# Altium schematic sheet Sheet1.SchDoc
size A4; SheetNumber: 1; SheetTotal: 3
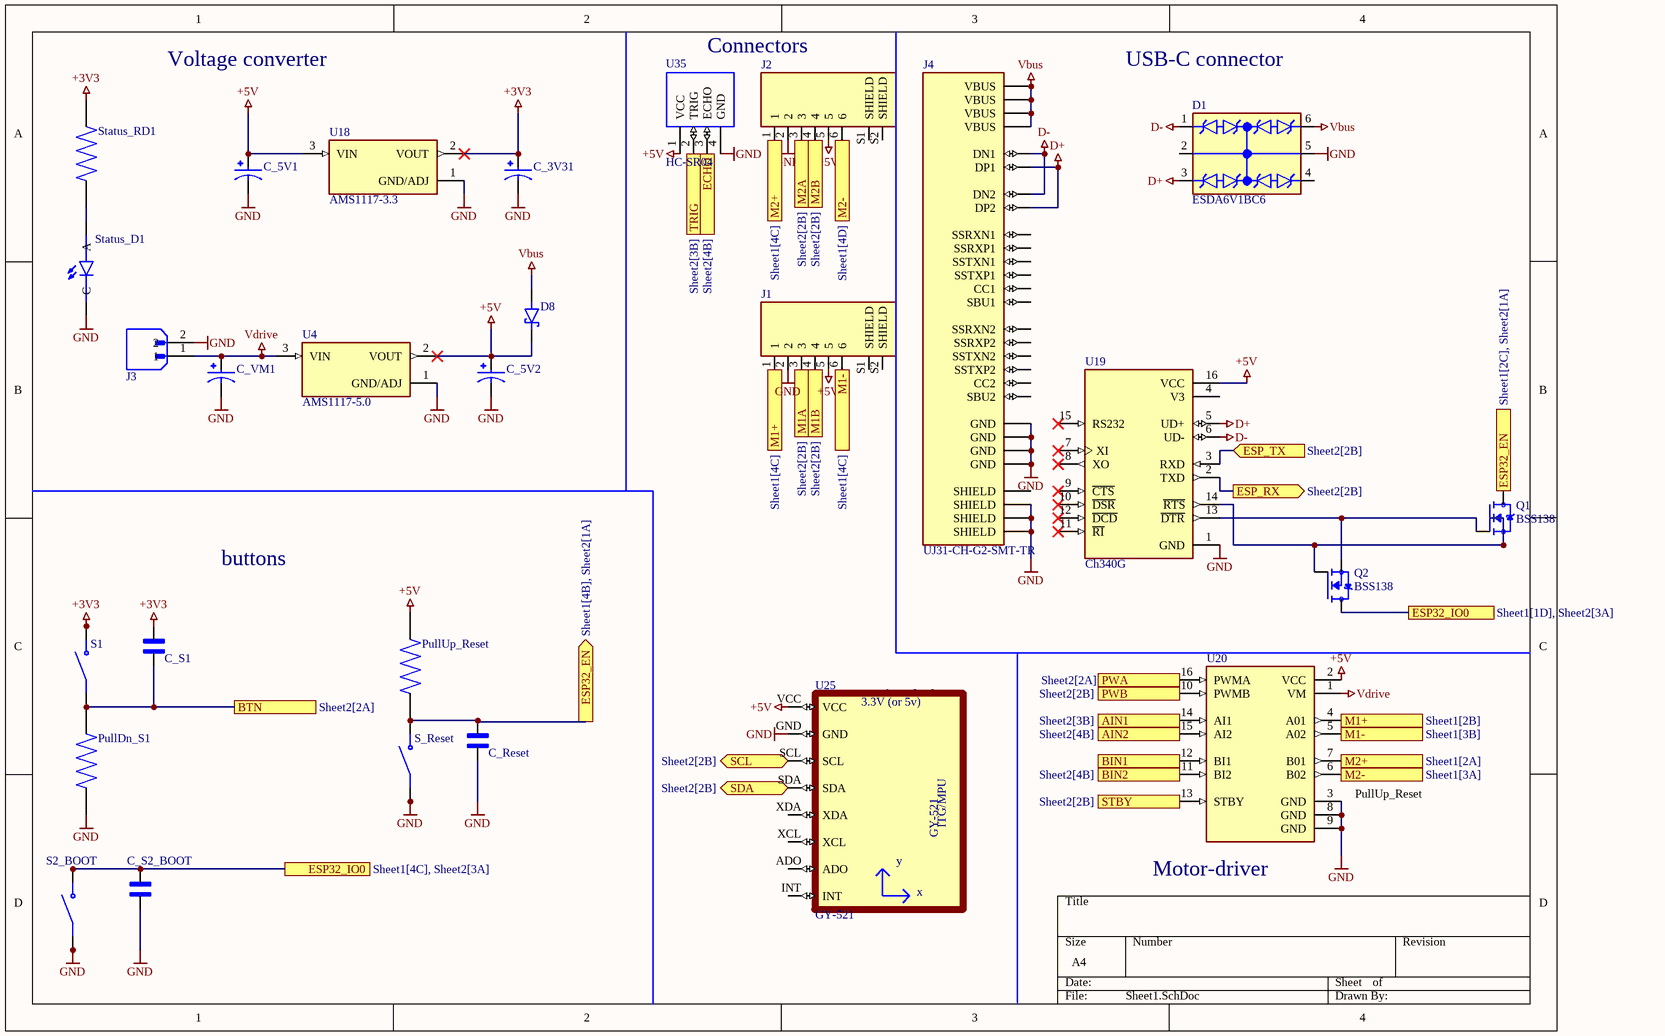
[diagram p0: Sheet1.SchDoc]

## Parts
C_3V31  EEE-HC1H3R3R  [CAP_EEEHC1H3R3R]  (value not drawn)
C_5V1  EEE-HC1H3R3R  [CAP_EEEHC1H3R3R]  (value not drawn)
C_5V2  EEE-HC1H3R3R  [CAP_EEEHC1H3R3R]  (value not drawn)
C_Reset  GRM033R61C224ME14D  [CAPC0603X33N]  (value not drawn)
C_S1  GRM033R61C224ME14D  [CAPC0603X33N]  (value not drawn)
C_S2_BOOT  GRM033R61C224ME14D  [CAPC0603X33N]  (value not drawn)
C_VM1  EEE-HC1H3R3R  [CAP_EEEHC1H3R3R]  (value not drawn)
D1  ESDA6V1BC6  [SOT95P280X145-6N]
D8  1N5819HW-7  [SOD3715X145N]  (value not drawn)
J1  S6B-PH-SM4-TB (LF)(SN)  [JST_S6B-PH-SM4-TB(LF)(SN)]  (value not drawn)
J2  S6B-PH-SM4-TB (LF)(SN)  [JST_S6B-PH-SM4-TB(LF)(SN)]  (value not drawn)
J3  S2B-XH-A-1(LF)(SN)  [JST_S2B-XH-A-1(LF)(SN)]  (value not drawn)
J4  UJ31-CH-G2-SMT-TR  [CUI_UJ31-CH-G2-SMT-TR]
PullDn_S1  CRG0402F4K7  [RESC1005X40N]  (value not drawn)
PullUp_Reset  CRG0402F4K7  [RESC1005X40N]  (value not drawn)
Q1  BSS138  [SOT95P240X111-3N]
Q2  BSS138  [SOT95P240X111-3N]
S1  FSM2JSMLTR  [SW_1571527-2]  (value not drawn)
S2_BOOT  FSM2JSMLTR  [SW_1571527-2]  (value not drawn)
S_Reset  FSM2JSMLTR  [SW_1571527-2]  (value not drawn)
Status_D1  597-5004-407F  [LEDSC160X80X70L45N]  (value not drawn)
Status_RD1  CRG0201F1K4  [RESC0603X26N]  (value not drawn)
U4  AMS1117-5.0  [SOT229P700X180-4N]
U18  AMS1117-3.3  [SOT229P700X180-4N]
U19  Ch340G  [SOIC127P600X180-16N]
U20  ROB-14450  [MODULE_ROB-14450]  (value not drawn)
U25  GY-521  [GY-521]
U35  HC-SR04  [XCVR_HC-SR04]

## Ports
AIN1 (in, see Sheet2[3B]), AIN2 (in, see Sheet2[4B]), BIN1 (in, see Sheet2[3B]), BIN2 (in, see Sheet2[4B]), BTN (see Sheet2[2A]), ECHO (see Sheet2[4B]), ESP32_EN (out, see Sheet1[2C], Sheet2[1A]), ESP32_EN (out, see Sheet1[4B], Sheet2[1A]), ESP32_IO0 (see Sheet1[1D], Sheet2[3A]), ESP32_IO0 (see Sheet1[4C], Sheet2[3A]), ESP_RX (out, see Sheet2[2B]), ESP_TX (in, see Sheet2[2B]), M1+ (out, see Sheet1[2B]), M1+ (out, see Sheet1[4C]), M1- (out, see Sheet1[3B]), M1- (out, see Sheet1[4C]), M1A (see Sheet2[2B]), M1B (see Sheet2[2B]), M2+ (out, see Sheet1[2A]), M2+ (out, see Sheet1[4C]), M2- (out, see Sheet1[3A]), M2- (out, see Sheet1[4D]), M2A (see Sheet2[2B]), M2B (see Sheet2[2B]), PWA (in, see Sheet2[2A]), PWB (in, see Sheet2[2B]), SCL (bidir, see Sheet2[2B]), SDA (bidir, see Sheet2[2B]), STBY (in, see Sheet2[2B]), TRIG (see Sheet2[3B])

## Nets
+3V3: C_3V31.1 C_S1.2 S1.3(NO) S1.4(NO) Status_RD1.1 U18.2(VOUT)
+5V: C_5V1.1 C_5V2.1 D8.C(K) J1.5 J2.5 PullUp_Reset.2 U4.2(VOUT) U18.3(VIN) U19.16(VCC) U20.2(VCC) U25.VCC U35.1(VCC)
D+: D1.3(C2) J4.A6(DP1) J4.B6(DP2) U19.5(UD+)
D-: D1.1(C1) J4.A7(DN1) J4.B7(DN2) U19.6(UD-)
GND: C_3V31.2 C_5V1.2 C_5V2.2 C_Reset.1 C_S2_BOOT.2 C_VM1.2 D1.5(CC2) J1.2 J2.2 J3.2 J4.A1(GND) J4.A12(GND) J4.B1(GND) J4.B12(GND) J4.SH2(SHIELD) J4.SH3(SHIELD) J4.SH4(SHIELD) PullDn_S1.1 S2_BOOT.1(COM) S2_BOOT.2(COM) S_Reset.1(COM) S_Reset.2(COM) Status_D1.C U4.1(GND/ADJ) U18.1(GND/ADJ) U19.1(GND) U20.3(GND) U20.8(GND) U20.9(GND) U25.GND U35.4(GND)
Vbus: D1.6(C4) D8.A J4.A4(VBUS) J4.A9(VBUS) J4.B4(VBUS) J4.B9(VBUS)
Vdrive: C_VM1.1 J3.1 U4.3(VIN) U20.1(VM)
AIN1: U20.14(AI1) ; port AIN1
AIN2: U20.15(AI2) ; port AIN2
BIN1: U20.12(BI1) ; port BIN1
BIN2: U20.11(BI2) ; port BIN2
BTN: C_S1.1 PullDn_S1.2 S1.1(COM) S1.2(COM) ; port BTN
ECHO: U35.3(ECHO) ; port ECHO
ESP32_EN: C_Reset.2 PullUp_Reset.1 Q1.3(D) S_Reset.3(NO) S_Reset.4(NO) ; port ESP32_EN
ESP32_IO0: C_S2_BOOT.1 Q2.3(D) S2_BOOT.3(NO) S2_BOOT.4(NO) ; port ESP32_IO0
ESP_RX: U19.2(TXD) ; port ESP_RX
ESP_TX: U19.3(RXD) ; port ESP_TX
M1+: J1.1 U20.4(A01) ; port M1+
M1-: J1.6 U20.5(A02) ; port M1-
M1A: J1.3 ; port M1A
M1B: J1.4 ; port M1B
M2+: J2.1 U20.7(B01) ; port M2+
M2-: J2.6 U20.6(B02) ; port M2-
M2A: J2.3 ; port M2A
M2B: J2.4 ; port M2B
PWA: U20.16(PWMA) ; port PWA
PWB: U20.10(PWMB) ; port PWB
SCL: U25.SCL ; port SCL
SDA: U25.SDA ; port SDA
STBY: U20.13(STBY) ; port STBY
TRIG: U35.2(TRIG) ; port TRIG
NetQ1_1: Q1.1(G) Q2.2(S) U19.13(~{DTR})
NetQ1_2: Q1.2(S) Q2.1(G) U19.14(~{RTS})
NetStatus_D1_A: Status_D1.A Status_RD1.2

Not connected (* = marked no-connect by the designer): D1 2(CC1) 4(C3); J1 S1(SHIELD) S2(SHIELD); J2 S1(SHIELD) S2(SHIELD); J4 A2(SSTXP1) A3(SSTXN1) A5(CC1) A8(SBU1) A10(SSRXN2) A11(SSRXP2) B2(SSTXP2) B3(SSTXN2) B5(CC2) B8(SBU2) B10(SSRXN1) B11(SSRXP1) SH1(SHIELD); U19 4(V3) 7(XI)* 8(XO)* 9(~{CTS})* 10(~{DSR})* 11(~{RI})* 12(~{DCD})* 15(RS232)*; U25 ADO INT XCL XDA

## Notes on the sheet
- Voltage converter
- Connectors
- USB-C connector
- buttons
- (near U20) PullUp_Reset
- (near U20) Motor-driver
- (in symbol GY-521) 3.3V (or 5v); ITG/MPU; y; x

## Library data of the parts
C_3V31 C_5V1 C_5V2 C_VM1 = EEE-HC1H3R3R: 10uF 16V dc Aluminium Electrolytic Capacitor; HC SMD Series 3000h 4(Dia.)x5.8mm; Value: 10µF; MF: Panasonic; Package: RADIAL-2 Panasonic; Availability: In Stock; Check_prices: https://www.snapeda.com/parts/EEE-HC1H3R3R/Panasonic/view-part/2309274/?ref=eda; Price: None; SnapEDA_Link: https://www.snapeda.com/parts/EEE-HC1H3R3R/Panasonic/view-part/2309274/?ref=snap; MP: EEE-HC1H3R3R; Supplier 1: Arrow Electronics; Supplier Part Number 1: VES100M1CTR-0405
C_Reset C_S1 C_S2_BOOT = GRM033R61C224ME14D: 0603; Value: 100n; MF: Murata; SnapEDA_Link: https://www.snapeda.com/parts/GRM033R61C224ME14D/Murata/view-part/?ref=snap; Package: 0603 Murata; MP: GRM033R61C224ME14D; Check_prices: https://www.snapeda.com/parts/GRM033R61C224ME14D/Murata/view-part/?ref=eda; ID: GRM033R61C224ME14D
D1 = ESDA6V1BC6: - Clamp - Ipp Tvs Diode Surface Mount SOT-23-6; MF: STMicroelectronics; Value: *; Price: None; Purchase-URL: https://pricing.snapeda.com/search/part/ESDA6V1BC6/?ref=eda; Package: SOT-23-6 STMicroelectronics; MP: ESDA6V1BC6; Availability: In Stock; Check_prices: https://www.snapeda.com/parts/ESDA6V1BC6/STMicroelectronics/view-part/?ref=eda; SnapEDA_Link: https://www.snapeda.com/parts/ESDA6V1BC6/STMicroelectronics/view-part/?ref=snap; Supplier 1: Mouser; Supplier Part Number 1: 511-ESDA6V1BC6
D8 = 1N5819HW-7: Diode Schottky 40 V 1A Surface Mount SOD-123; MF: Diodes Inc.; SnapEDA_Link: https://www.snapeda.com/parts/1N5819HW-7/Diodes+Inc./view-part/?ref=snap; Price: None; Check_prices: https://www.snapeda.com/parts/1N5819HW-7/Diodes+Inc./view-part/?ref=eda; Availability: In Stock; Value: *; MP: 1N5819HW-7; Package: SOD-123 Fairchild Semiconductor; Purchase-URL: https://pricing.snapeda.com/search/part/1N5819HW-7/?ref=eda
J1 J2 = S6B-PH-SM4-TB (LF)(SN): Connector Header Surface Mount, Right Angle 6 position 0.079 (2.00mm); MF: JST Sales; SnapEDA_Link: https://www.snapeda.com/parts/S6B-PH-SM4-TB%20(LF)(SN)/JST/view-part/?ref=snap; Package: None; Value: *; MP: S6B-PH-SM4-TB (LF)(SN); Check_prices: https://www.snapeda.com/parts/S6B-PH-SM4-TB%20(LF)(SN)/JST/view-part/?ref=eda; Supplier 1: Rs; Supplier Part Number 1: 6881369P
J3 = S2B-XH-A-1(LF)(SN): Connector Header Through Hole, Right Angle 2 position 0.098 (2.50mm); MF: JST Sales; SnapEDA_Link: https://www.snapeda.com/parts/S2B-XH-A-1(LF)(SN)/JST+Sales+America+Inc./view-part/?ref=snap; Package: None; Value: *; MP: S2B-XH-A-1(LF)(SN); Check_prices: https://www.snapeda.com/parts/S2B-XH-A-1(LF)(SN)/JST+Sales+America+Inc./view-part/?ref=eda; Supplier 1: Mouser; Supplier Part Number 1: 306-S2BXHA1LFSN
J4 = UJ31-CH-G2-SMT-TR: Type C, USB 3.2 Gen 2, 10 Gbps, 20 Vdc, 5 A, Right Angle, Surface Mount, Black Insulator, USB Receptacle; MF: Same Sky; SnapEDA_Link: https://www.snapeda.com/parts/UJ31-CH-G2-SMT-TR/Same+Sky/view-part/?ref=snap; Package: None; Value: *; MP: UJ31-CH-G2-SMT-TR; Check_prices: https://www.snapeda.com/parts/UJ31-CH-G2-SMT-TR/Same+Sky/view-part/?ref=eda; Supplier 1: Mouser; Supplier Part Number 1: 490-UJ31-CH-G2SMT-TR
PullDn_S1 PullUp_Reset = CRG0402F4K7: Thick Film Smnt Resistor 0402 Case 4.7kOhm +/-1% 0.063W +/-100ppm/degC | TE Connectivity CRG0402F4K7; Power_Rating: .063 W; Resistance: 10k; Voltage_Rating: 50 V; Tolerance: 1%; SnapEDA_Link: https://www.snapeda.com/parts/CRG0402F4K7/TE+Connectivity+Passive+Product/view-part/?ref=snap; Package: 0402; Value: *; MF: TE Connectivity; MP: CRG0402F4K7; Check_prices: https://www.snapeda.com/parts/CRG0402F4K7/TE+Connectivity+Passive+Product/view-part/?ref=eda
Q1 Q2 = BSS138: N-Channel 50 V 220mA (Ta) 350mW (Ta) Surface Mount SOT-23-3; MF: onsemi; SnapEDA_Link: https://www.snapeda.com/parts/BSS138/Onsemi/view-part/?ref=snap; Package: SOT-23-3 ON Semiconductor; Value: *; MP: BSS138; Check_prices: https://www.snapeda.com/parts/BSS138/Onsemi/view-part/?ref=eda; Supplier 1: Future Electronics; Supplier Part Number 1: 7723794
S1 S2_BOOT S_Reset = FSM2JSMLTR: Switch Tactile OFF (ON) SPST Round Button Gull Wing 0.05A 24VDC 0.98N SMD T/R; MF: TE Connectivity; SnapEDA_Link: https://www.snapeda.com/parts/FSM2JSMLTR/TE+Connectivity+ALCOSWITCH+Switches/view-part/?ref=snap; Package: None; Value: *; MP: FSM2JSMLTR; Check_prices: https://www.snapeda.com/parts/FSM2JSMLTR/TE+Connectivity+ALCOSWITCH+Switches/view-part/?ref=eda; Supplier 1: Avnet; Supplier Part Number 1: 23R8458
Status_D1 = 597-5004-407F: SMD LED 0603 R 7 REEL; Discretes | Dialight 597-5004-407F; SnapEDA_Link: https://www.snapeda.com/parts/597-5004-407F/Dialight/view-part/?ref=snap; Package: 0603 Dialight; Value: *; MF: Dialight; MP: 597-5004-407F; Check_prices: https://www.snapeda.com/parts/597-5004-407F/Dialight/view-part/?ref=eda; Supplier 1: Farnell; Supplier Part Number 1: 1867024
Status_RD1 = CRG0201F1K4: Res Thick Film 0201 100 Ohm 1% 1/20W Â±200ppm/Â°C Molded SMD T/R; Power_Rating: .05 W; Resistance: 100; MF: TE Connectivity; Voltage_Rating: 25 V; SnapEDA_Link: https://www.snapeda.com/parts/CRG0201F1K4/TE+Connectivity/view-part/?ref=snap; Package: 0201; Value: *; MP: CRG0201F1K4; EU_RoHS_Compliance: Compliant with Exemptions; Tolerance: 1%; Check_prices: https://www.snapeda.com/parts/CRG0201F1K4/TE+Connectivity/view-part/?ref=eda; Supplier 1: Rs; Supplier Part Number 1: 7550164
U4 = AMS1117-5.0: 1A LOW DROPOUT VOLTAGE REGULATOR; MF: ams; SnapEDA_Link: https://www.snapeda.com/parts/AMS1117-5.0/ams/view-part/?ref=snap; Package: SOT-223 Seeed Technology; Value: *; MP: AMS1117-5.0; Check_prices: https://www.snapeda.com/parts/AMS1117-5.0/ams/view-part/?ref=eda
U18 = AMS1117-3.3: Sot223/Pkg 1-Amp 3.3-Volt Low Drop Out Voltage Regulatator; MF: Advanced Monolithic Systems; SnapEDA_Link: https://www.snapeda.com/parts/AMS1117-3.3/Advanced+Monolithic+Systems/view-part/?ref=snap; Package: SOT-223 Seeed Technology; Value: *; MP: AMS1117-3.3; Check_prices: https://www.snapeda.com/parts/AMS1117-3.3/Advanced+Monolithic+Systems/view-part/?ref=eda; Supplier 1: Digikey; Supplier Part Number 1: 4518-AMS1117-3.3CT-ND
U19 = Ch340G: USB Interface Integrated Circuit; MF: WCH; SnapEDA_Link: https://www.snapeda.com/parts/Ch340G/WCH/view-part/?ref=snap; Package: None; Value: *; MP: Ch340G; Check_prices: https://www.snapeda.com/parts/Ch340G/WCH/view-part/?ref=eda
U20 = ROB-14450: TB6612FNG Motor Controller/Driver Power Management Evaluation Board; MF: SparkFun Electronics; Check_prices: https://www.snapeda.com/parts/ROB-14450/SparkFun%20Electronics/view-part/2656367/?ref=eda; Package: None; MP: ROB-14450; Value: *; Availability: In Stock; SnapEDA_Link: https://www.snapeda.com/parts/ROB-14450/SparkFun%20Electronics/view-part/2656367/?ref=snap; Price: None
U25 = GY-521: Triple Axis Accelerometer Gyro Breakout; MF: GODREAM FORDREAM CO., LIMITED; SnapEDA_Link: https://www.snapeda.com/parts/GY-521/GODREAM+FORDREAM+CO.%252C+LIMITED/view-part/?ref=snap; Package: Package; Value: *; MP: GY-521; Check_prices: https://www.snapeda.com/parts/GY-521/GODREAM+FORDREAM+CO.%252C+LIMITED/view-part/?ref=eda
U35 = HC-SR04: Ultrasonic Sensor Module; Availability: Unavailable; MP: HC-SR04; Value: *; Price: None; Package: None